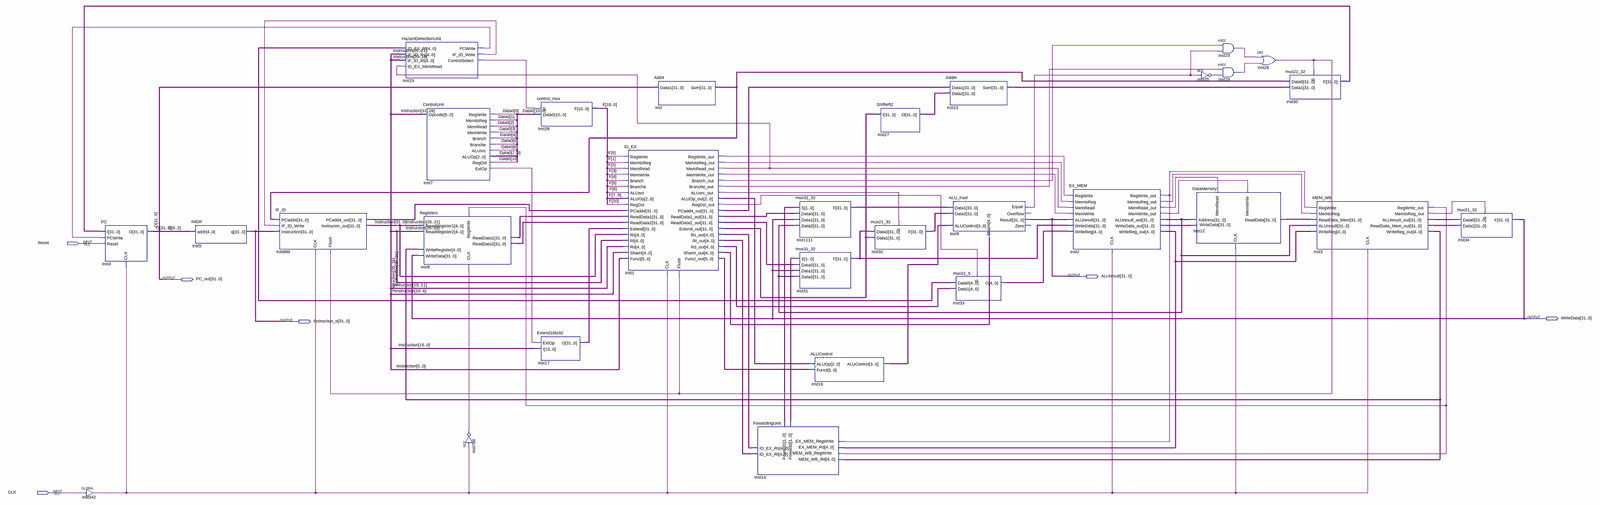
[diagram p0: schematic sheet, whole]
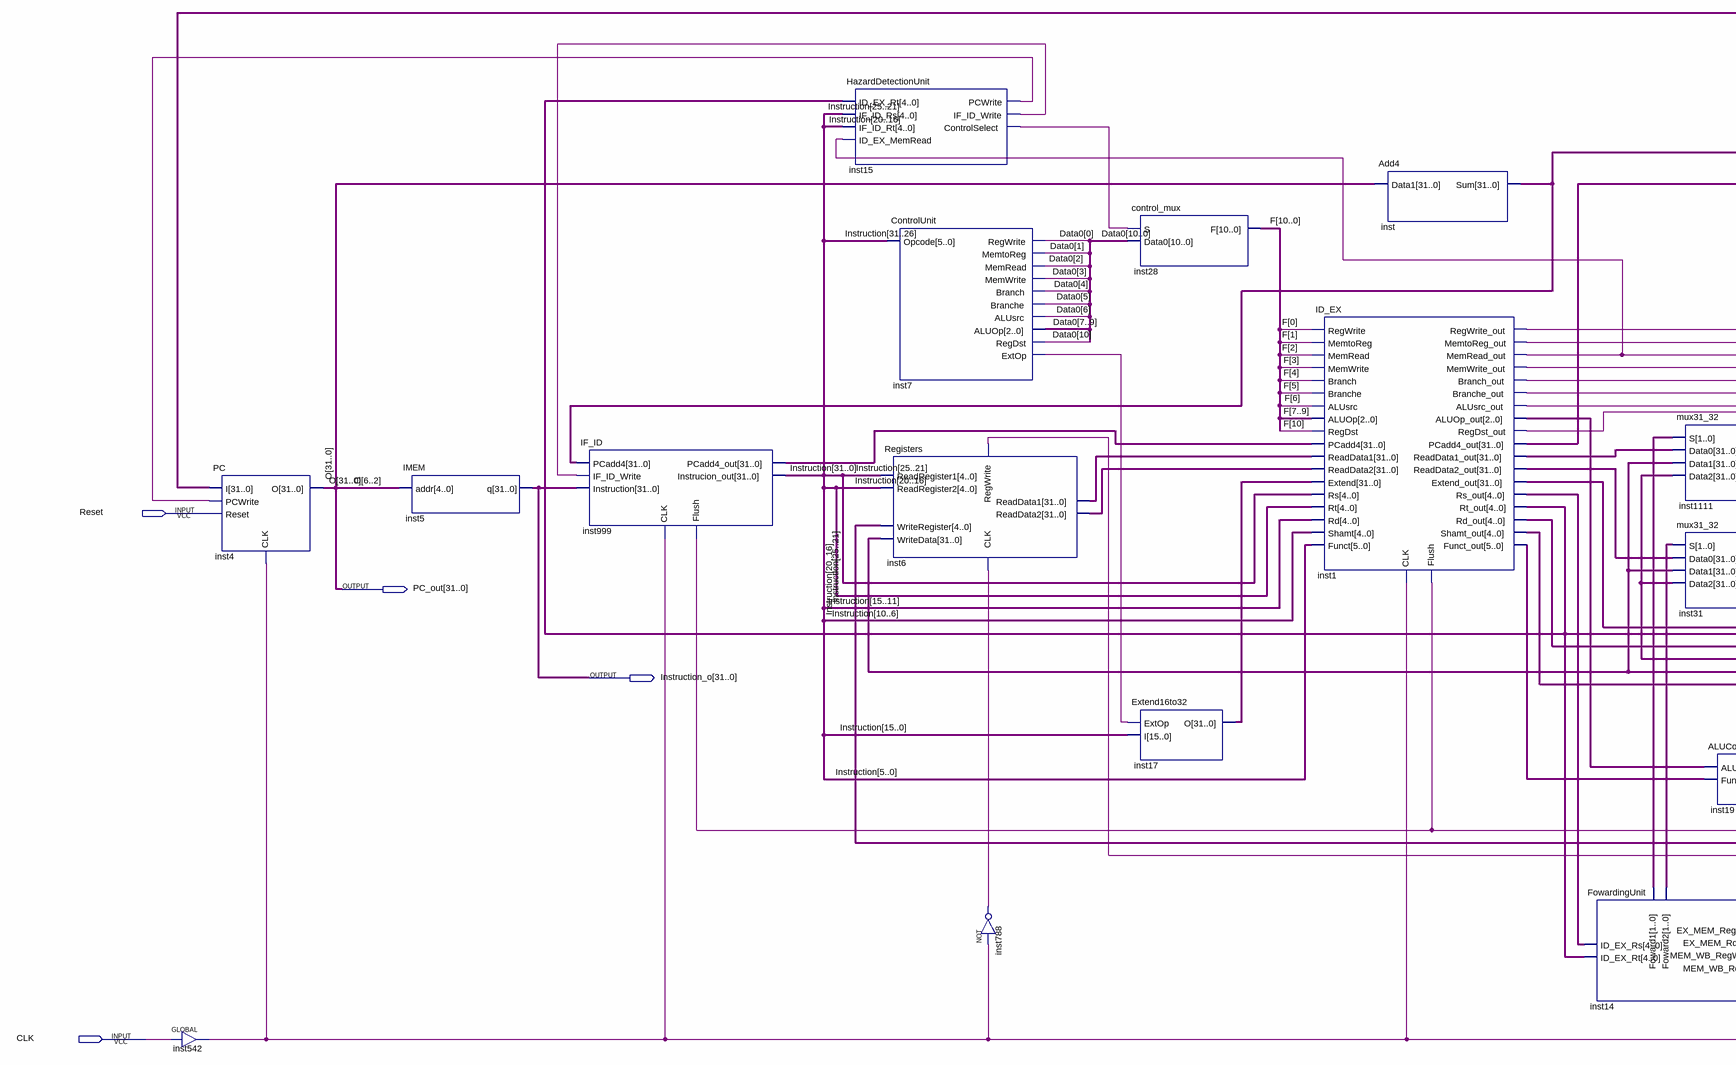
[diagram p1: schematic sheet, left part]
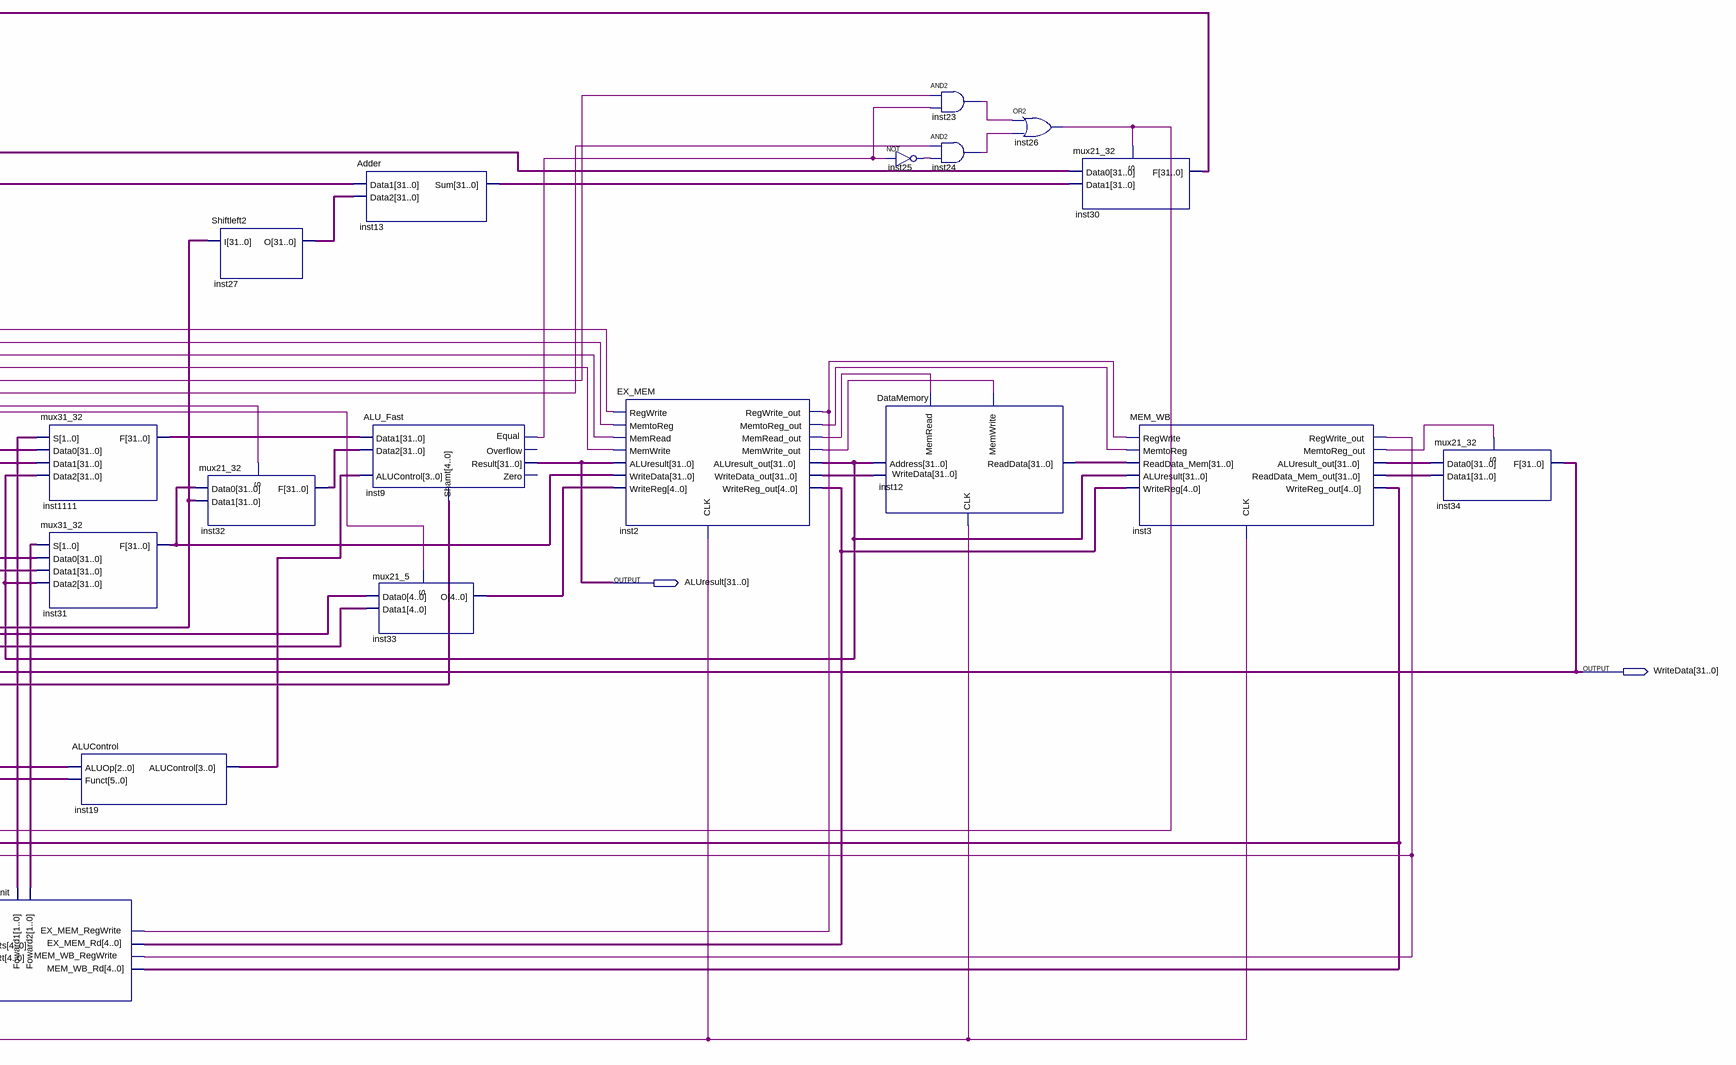
[diagram p2: schematic sheet, right part]
// Quartus schematic cpu_pipiline_promax.bdf as structural Verilog: 30 symbols, 6 pins
module cpu_pipiline_promax (
  input  Reset,
  input  CLK,
  output [31:0] ALUresult,
  output [31:0] PC_out,
  output [31:0] WriteData,
  output [31:0] Instruction_o
);

  wire inst1_alusrc_out, inst1_branch_out, inst1_branche_out, inst1_memread_out, inst1_memtoreg_out,
       inst1_memwrite_out, inst1_regdst_out, inst1_regwrite_out, inst2_memread_out, inst2_memtoreg_out,
       inst2_memwrite_out, inst2_regwrite_out, inst3_memtoreg_out, inst3_regwrite_out, inst7_extop,
       inst9_equal, inst15_controlselect, inst15_if_id_write, inst15_pcwrite, inst23_out, inst24_out,
       inst25_out, inst26_out, inst542_out, inst788_out;
  wire [1:0] inst14_foward1, inst14_foward2;
  wire [2:0] inst1_aluop_out;
  wire [3:0] inst19_alucontrol;
  wire [4:0] inst1_rd_out, inst1_rs_out, inst1_rt_out, inst1_shamt_out, inst2_writereg_out,
       inst3_writereg_out, inst33_o;
  wire [5:0] inst1_funct_out;
  wire [10:0] Data0, F;
  wire [31:0] inst1_extend_out, inst1_pcadd4_out, inst1_readdata1_out, inst1_readdata2_out,
       inst2_aluresult_out, inst2_writedata_out, inst3_aluresult_out, inst3_readdata_mem_out,
       inst6_readdata1, inst6_readdata2, inst12_readdata, inst13_sum, inst17_o, inst27_o, inst30_f, inst31_f,
       inst32_f, inst999_pcadd4_out, inst1111_f, inst_sum, Instruction;

  PC inst4 (.I(inst30_f), .PCWrite(inst15_pcwrite), .Reset(Reset), .CLK(inst542_out), .O(PC_out));
  GLOBAL inst542 (.IN(CLK), .OUT(inst542_out));
  IMEM inst5 (.addr(PC_out[6:2]), .q(Instruction_o));
  IF_ID inst999 (
    .PCadd4(inst_sum), .IF_ID_Write(inst15_if_id_write), .Instruction(Instruction_o), .CLK(inst542_out),
    .Flush(inst26_out), .PCadd4_out(inst999_pcadd4_out), .Instrucion_out(Instruction));
  HazardDetectionUnit inst15 (
    .ID_EX_Rt(inst1_rt_out), .IF_ID_Rs(Instruction[25:21]), .IF_ID_Rt(Instruction[20:16]),
    .ID_EX_MemRead(inst1_memread_out), .PCWrite(inst15_pcwrite), .IF_ID_Write(inst15_if_id_write),
    .ControlSelect(inst15_controlselect));
  ControlUnit inst7 (
    .Opcode(Instruction[31:26]), .RegDst(Data0[10]), .RegWrite(Data0[0]), .ALUsrc(Data0[6]),
    .Branch(Data0[4]), .Branche(Data0[5]), .MemRead(Data0[2]), .MemWrite(Data0[3]), .MemtoReg(Data0[1]),
    .ExtOp(inst7_extop), .ALUOp({Data0[7], Data0[8], Data0[9]}));
  Registers inst6 (
    .ReadRegister1(Instruction[25:21]), .WriteData(WriteData), .ReadRegister2(Instruction[20:16]),
    .WriteRegister(inst3_writereg_out), .CLK(inst788_out), .RegWrite(inst3_regwrite_out),
    .ReadData1(inst6_readdata1), .ReadData2(inst6_readdata2));
  not inst788 (inst788_out, inst542_out);
  control_mux inst28 (.S(inst15_controlselect), .Data0(Data0), .F(F));
  Extend16to32 inst17 (.ExtOp(inst7_extop), .I(Instruction[15:0]), .O(inst17_o));
  ID_EX inst1 (
    .RegWrite(F[0]), .MemtoReg(F[1]), .MemRead(F[2]), .MemWrite(F[3]), .Branch(F[4]), .Branche(F[5]),
    .ALUsrc(F[6]), .ALUOp({F[7], F[8], F[9]}), .RegDst(F[10]), .PCadd4(inst999_pcadd4_out),
    .ReadData1(inst6_readdata1), .ReadData2(inst6_readdata2), .Extend(inst17_o), .Rs(Instruction[25:21]),
    .Rt(Instruction[20:16]), .Rd(Instruction[15:11]), .Shamt(Instruction[10:6]), .Funct(Instruction[5:0]),
    .CLK(inst542_out), .Flush(inst26_out), .RegWrite_out(inst1_regwrite_out),
    .MemtoReg_out(inst1_memtoreg_out), .MemRead_out(inst1_memread_out), .MemWrite_out(inst1_memwrite_out),
    .Branch_out(inst1_branch_out), .Branche_out(inst1_branche_out), .ALUsrc_out(inst1_alusrc_out),
    .ALUOp_out(inst1_aluop_out), .RegDst_out(inst1_regdst_out), .PCadd4_out(inst1_pcadd4_out),
    .ReadData1_out(inst1_readdata1_out), .ReadData2_out(inst1_readdata2_out), .Extend_out(inst1_extend_out),
    .Rs_out(inst1_rs_out), .Rt_out(inst1_rt_out), .Rd_out(inst1_rd_out), .Shamt_out(inst1_shamt_out),
    .Funct_out(inst1_funct_out));
  Add4 inst (.Data1(PC_out), .Sum(inst_sum));
  FowardingUnit inst14 (
    .ID_EX_Rs(inst1_rs_out), .ID_EX_Rt(inst1_rt_out), .EX_MEM_RegWrite(inst2_regwrite_out),
    .EX_MEM_Rd(inst2_writereg_out), .MEM_WB_RegWrite(inst3_regwrite_out), .MEM_WB_Rd(inst3_writereg_out),
    .Foward1(inst14_foward1), .Foward2(inst14_foward2));
  mux31_32 inst1111 (
    .S(inst14_foward1), .Data0(inst1_readdata1_out), .Data1(WriteData), .Data2(inst2_aluresult_out),
    .F(inst1111_f));
  mux31_32 inst31 (
    .S(inst14_foward2), .Data0(inst1_readdata2_out), .Data1(WriteData), .Data2(inst2_aluresult_out),
    .F(inst31_f));
  ALUControl inst19 (.ALUOp(inst1_aluop_out), .Funct(inst1_funct_out), .ALUControl(inst19_alucontrol));
  mux21_32 inst32 (.Data0(inst31_f), .Data1(inst1_extend_out), .S(inst1_alusrc_out), .F(inst32_f));
  Shiftleft2 inst27 (.I(inst1_extend_out), .O(inst27_o));
  Adder inst13 (.Data1(inst1_pcadd4_out), .Data2(inst27_o), .Sum(inst13_sum));
  ALU_Fast inst9 (
    .Data1(inst1111_f), .Data2(inst32_f), .ALUControl(inst19_alucontrol), .Shamt(inst1_shamt_out),
    .Result(ALUresult), .Equal(inst9_equal));  // open: Zero, Overflow
  mux21_5 inst33 (.Data0(inst1_rt_out), .Data1(inst1_rd_out), .S(inst1_regdst_out), .O(inst33_o));
  EX_MEM inst2 (
    .RegWrite(inst1_regwrite_out), .MemtoReg(inst1_memtoreg_out), .MemRead(inst1_memread_out),
    .MemWrite(inst1_memwrite_out), .ALUresult(ALUresult), .WriteData(inst31_f), .WriteReg(inst33_o),
    .CLK(inst542_out), .RegWrite_out(inst2_regwrite_out), .MemtoReg_out(inst2_memtoreg_out),
    .MemRead_out(inst2_memread_out), .MemWrite_out(inst2_memwrite_out), .ALUresult_out(inst2_aluresult_out),
    .WriteData_out(inst2_writedata_out), .WriteReg_out(inst2_writereg_out));
  not inst25 (inst25_out, inst9_equal);
  DataMemory inst12 (
    .WriteData(inst2_writedata_out), .Address(inst2_aluresult_out), .MemRead(inst2_memread_out),
    .MemWrite(inst2_memwrite_out), .CLK(inst542_out), .ReadData(inst12_readdata));
  and inst23 (inst23_out, inst1_branch_out, inst9_equal);
  and inst24 (inst24_out, inst1_branche_out, inst25_out);
  or inst26 (inst26_out, inst23_out, inst24_out);
  mux21_32 inst30 (.Data0(inst_sum), .Data1(inst13_sum), .S(inst26_out), .F(inst30_f));
  MEM_WB inst3 (
    .RegWrite(inst2_regwrite_out), .MemtoReg(inst2_memtoreg_out), .ReadData_Mem(inst12_readdata),
    .ALUresult(inst2_aluresult_out), .WriteReg(inst2_writereg_out), .CLK(inst542_out),
    .RegWrite_out(inst3_regwrite_out), .MemtoReg_out(inst3_memtoreg_out),
    .ReadData_Mem_out(inst3_readdata_mem_out), .ALUresult_out(inst3_aluresult_out),
    .WriteReg_out(inst3_writereg_out));
  mux21_32 inst34 (.Data0(inst3_aluresult_out), .Data1(inst3_readdata_mem_out), .S(inst3_memtoreg_out), .F(WriteData));

  // Other names for the same wires on the sheet: O[31:0] = PC_out
endmodule
